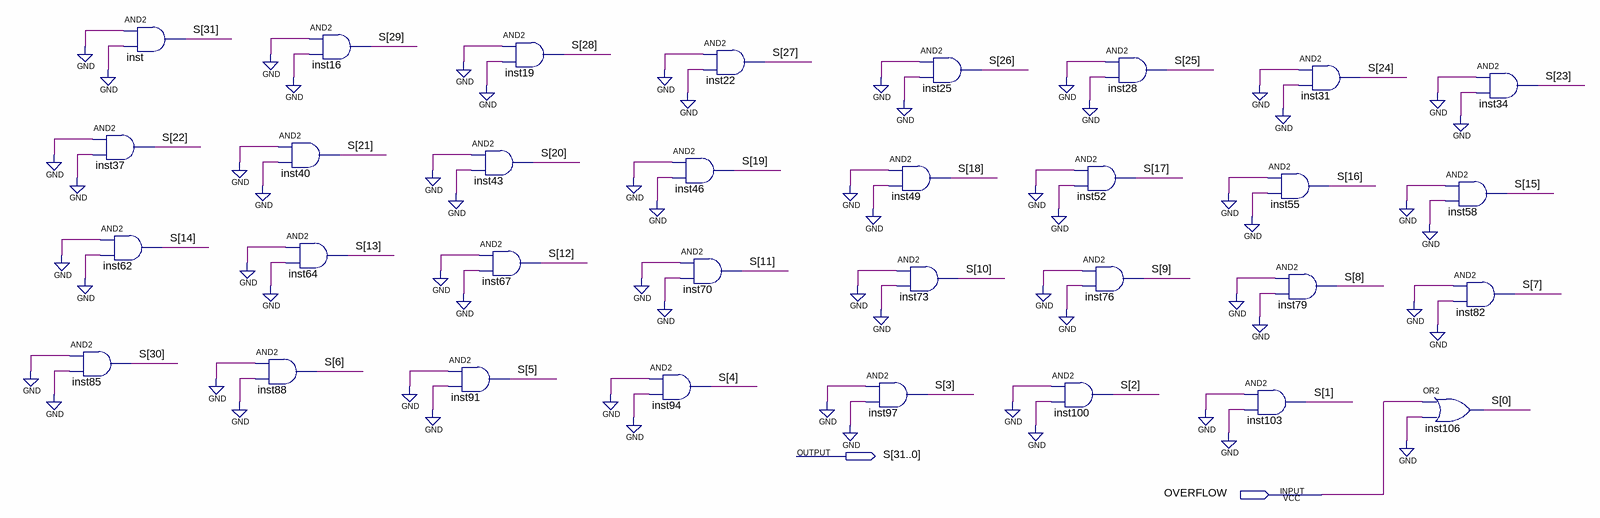
[diagram p0: schematic sheet]
// Quartus schematic slt.bdf as structural Verilog: 32 symbols, 2 pins
module slt (
  input  OVERFLOW,
  output [31:0] S
);

  and inst37 (S[22], 1'b0, 1'b0);
  and inst62 (S[14], 1'b0, 1'b0);
  and inst85 (S[30], 1'b0, 1'b0);
  and inst (S[31], 1'b0, 1'b0);
  and inst40 (S[21], 1'b0, 1'b0);
  and inst64 (S[13], 1'b0, 1'b0);
  and inst88 (S[6], 1'b0, 1'b0);
  and inst16 (S[29], 1'b0, 1'b0);
  and inst43 (S[20], 1'b0, 1'b0);
  and inst67 (S[12], 1'b0, 1'b0);
  and inst91 (S[5], 1'b0, 1'b0);
  and inst19 (S[28], 1'b0, 1'b0);
  and inst94 (S[4], 1'b0, 1'b0);
  and inst22 (S[27], 1'b0, 1'b0);
  and inst46 (S[19], 1'b0, 1'b0);
  and inst70 (S[11], 1'b0, 1'b0);
  and inst49 (S[18], 1'b0, 1'b0);
  and inst73 (S[10], 1'b0, 1'b0);
  and inst97 (S[3], 1'b0, 1'b0);
  and inst25 (S[26], 1'b0, 1'b0);
  and inst52 (S[17], 1'b0, 1'b0);
  and inst76 (S[9], 1'b0, 1'b0);
  and inst100 (S[2], 1'b0, 1'b0);
  and inst28 (S[25], 1'b0, 1'b0);
  and inst55 (S[16], 1'b0, 1'b0);
  and inst79 (S[8], 1'b0, 1'b0);
  and inst103 (S[1], 1'b0, 1'b0);
  and inst31 (S[24], 1'b0, 1'b0);
  and inst58 (S[15], 1'b0, 1'b0);
  and inst82 (S[7], 1'b0, 1'b0);
  or inst106 (S[0], OVERFLOW, 1'b0);
  and inst34 (S[23], 1'b0, 1'b0);
endmodule
